# EAGLE design ElectronPhotonTestHarness (EAGLE 7.4.0)
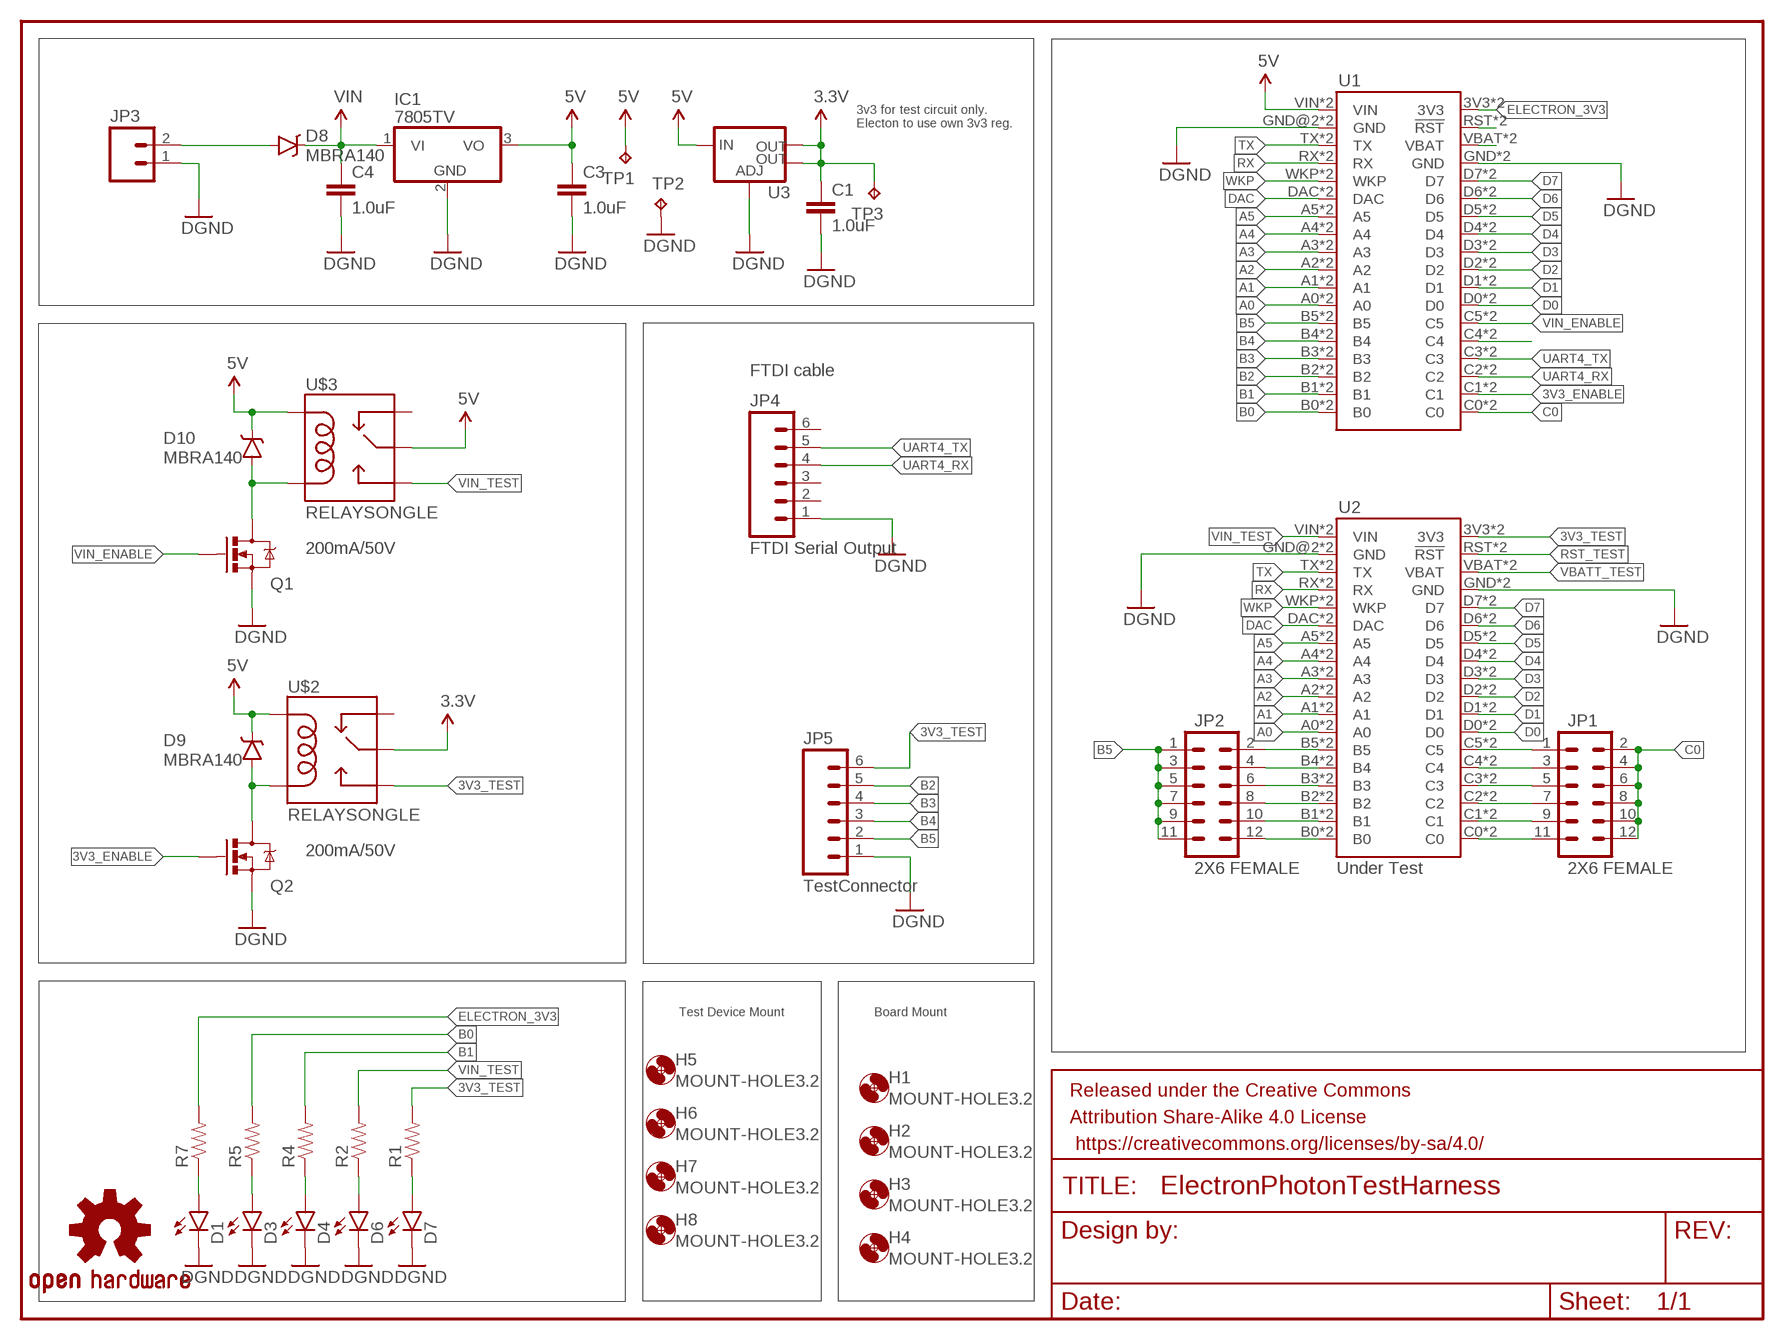
[diagram p0: schematic, sheet 1]

## Parts
C1  1.0uF  1.0UF-25V-+80/-20(0805)"  [0805-CAP]
C3  1.0uF  1.0UF-25V-+80/-20(0805)"  [0805-CAP]
C4  1.0uF  1.0UF-25V-+80/-20(0805)"  [0805-CAP]
D1  LED1206-BOTTOM  [LED-1206-BOTTOM]
D3  LED1206  [LED-1206]
D4  LED1206  [LED-1206]
D6  LED1206  [LED-1206]
D7  LED1206  [LED-1206]
D8  MBRA140  [SMA-DIODE]
D9  MBRA140  [SMA-DIODE]
D10  MBRA140  [SMA-DIODE]
FRAME1  FRAME-LETTER  [CREATIVE_COMMONS]
H1  MOUNT-HOLE3.2  [3,2]
H2  MOUNT-HOLE3.2  [3,2]
H3  MOUNT-HOLE3.2  [3,2]
H4  MOUNT-HOLE3.2  [3,2]
H5  MOUNT-HOLE3.2  [3,2]
H6  MOUNT-HOLE3.2  [3,2]
H7  MOUNT-HOLE3.2  [3,2]
H8  MOUNT-HOLE3.2  [3,2]
IC1  7805TV  [TO220V]
JP1  2X6 FEMALE  M06X2PTH_FEMALE  [2X6]
JP2  2X6 FEMALE  M06X2PTH_FEMALE  [2X6]
JP3  M025MM  [SCREWTERMINAL-5MM-2]
JP4  FTDI Serial Output  M06SILK_FEMALE_PTH  [1X06]
JP5  TestConnector  M06SILK_FEMALE_PTH  [1X06]
LOGO1  OSHW-LOGOL  [OSHW-LOGO-L]
Q1  200mA/50V  MOSFET-NCHANNELBSS138  [SOT23-3]
Q2  200mA/50V  MOSFET-NCHANNELBSS138  [SOT23-3]
R1  RESISTOR1206  [1206]
R2  RESISTOR1206  [1206]
R4  RESISTOR1206  [1206]
R5  RESISTOR1206  [1206]
R7  RESISTOR1206  [1206]
TP1  TPTP12SQ  [TP12SQ]
TP2  TPTP12SQ  [TP12SQ]
TP3  TPTP12SQ  [TP12SQ]
U1  ELECTRONDUALNAMED  [ELECTRON_SIMPLE_SILK_NAMES_DUAL]
U2  UnderTest  ELECTRONDUALNAMED  [ELECTRON_SIMPLE_SILK_NAMES_DUAL]
U3  V_REG_LM1117SOT223  [SOT223]
U$2  RELAYSONGLE  [SRD-5VDC-SL-C]
U$3  RELAYSONGLE  [SRD-5VDC-SL-C]

## Nets
3.3V: C1.1 TP3.TP U3.2(OUT) U3.4(OUT) U$2.COMMON(MAIN)
3V3_ENABLE: Q2.1(G) U1.C1 U1.C1_1(C1)
3V3_TEST: JP5.6 R1.2 U2.3V3 U2.3V3_1(3V3) U$2.OPEN(NO)
5V: C3.1 D9.C D10.C IC1.3(VO) TP1.TP U1.VIN U1.VIN_1B(VIN) U3.3(IN) U$2.COIL1 U$3.COIL1 U$3.COMMON(MAIN)
A0: U1.A0 U1.A0_1(A0) U2.A0 U2.A0_1(A0)
A1: U1.A1 U1.A1_1(A1) U2.A1 U2.A1_1(A1)
A2: U1.A2 U1.A2_1(A2) U2.A2 U2.A2_1(A2)
A3: U1.A3 U1.A3_1(A3) U2.A3 U2.A3_1(A3)
A4: U1.A4 U1.A4_1(A4) U2.A4 U2.A4_1(A4)
A5: U1.A5 U1.A5_1(A5) U2.A5 U2.A5_1(A5)
B0: R5.2 U1.B0 U1.B0_1(B0)
B1: R4.2 U1.B1 U1.B1_1(B1)
B2: JP5.5 U1.B2 U1.B2_1(B2)
B3: JP5.4 U1.B3 U1.B3_1(B3)
B4: JP5.3 U1.B4 U1.B4_1(B4)
B5: JP2.1 JP2.3 JP2.5 JP2.7 JP2.9 JP2.11 JP5.2 U1.B5 U1.B5_1(B5)
C0: JP1.2 JP1.4 JP1.6 JP1.8 JP1.10 JP1.12 U1.C0 U1.C0_1(C0)
D0: U1.D0 U1.D0_1(D0) U2.D0 U2.D0_1(D0)
D1: U1.D1 U1.D1_1(D1) U2.D1 U2.D1_1(D1)
D2: U1.D2 U1.D2_1(D2) U2.D2 U2.D2_1(D2)
D3: U1.D3 U1.D3_1(D3) U2.D3 U2.D3_1(D3)
D4: U1.D4 U1.D4_1(D4) U2.D4 U2.D4_1(D4)
D5: U1.D5 U1.D5_1(D5) U2.D5 U2.D5_1(D5)
D6: U1.D6 U1.D6_1(D6) U2.D6 U2.D6_1(D6)
D7: U1.D7 U1.D7_1(D7) U2.D7 U2.D7_1(D7)
DAC: U1.DAC U1.DAC_1(DAC) U2.DAC U2.DAC_1(DAC)
ELECTRON_3V3: R7.2 U1.3V3 U1.3V3_1(3V3)
GND: C1.2 C3.2 C4.2 D1.C D3.C D4.C D6.C D7.C IC1.2(GND) JP3.1 JP4.1 JP5.1 Q1.2(S) Q2.2(S) TP2.TP U1.GND U1.GND@2(GND) U1.GND_1(GND) U1.GND_1B(GND) U2.GND U2.GND@2(GND) U2.GND_1(GND) U2.GND_1B(GND) U3.1(ADJ) ; supply symbol labelled DGND
N$1: JP2.2 U2.B5 U2.B5_1(B5)
N$2: JP2.4 U2.B4 U2.B4_1(B4)
N$3: JP2.6 U2.B3 U2.B3_1(B3)
N$4: JP2.8 U2.B2 U2.B2_1(B2)
N$5: JP2.10 U2.B1 U2.B1_1(B1)
N$6: JP2.12 U2.B0 U2.B0_1(B0)
N$7: JP1.11 U2.C0 U2.C0_1(C0)
N$8: JP1.9 U2.C1 U2.C1_1(C1)
N$9: JP1.7 U2.C2 U2.C2_1(C2)
N$10: JP1.5 U2.C3 U2.C3_1(C3)
N$11: JP1.3 U2.C4 U2.C4_1(C4)
N$12: JP1.1 U2.C5 U2.C5_1(C5)
N$13: D1.A R7.1
N$14: U1.RST(!RST) U1.RST_1(!RST)
N$15: D3.A R5.1
N$16: D4.A R4.1
N$17: U1.VBAT U1.VBATT_1(VBAT)
N$18: D6.A R2.1
N$19: D7.A R1.1
N$20: D8.A JP3.2
N$21: U1.C4 U1.C4_1(C4)
RELAY_3V3: D9.A Q2.3(D) U$2.COIL2
RELAY_5V: D10.A Q1.3(D) U$3.COIL2
RST_TEST: U2.RST(!RST) U2.RST_1(!RST)
RX: U1.RX U1.RX_1(RX) U2.RX U2.RX_1(RX)
TX: U1.TX U1.TX_1(TX) U2.TX U2.TX_1(TX)
UART4_RX: JP4.4 U1.C2 U1.C2_1(C2)
UART4_TX: JP4.5 U1.C3 U1.C3_1(C3)
VBATT_TEST: U2.VBAT U2.VBATT_1(VBAT)
VIN: C4.1 D8.C IC1.1(VI)
VIN_ENABLE: Q1.1(G) U1.C5 U1.C5_1(C5)
VIN_TEST: R2.2 U2.VIN U2.VIN_1B(VIN) U$3.OPEN(NO)
WKP: U1.WKP U1.WKP_1(WKP) U2.WKP U2.WKP_1(WKP)
Unconnected: JP4.2 JP4.3 JP4.6 U$2.CLOSED(NC) U$3.CLOSED(NC)

## Notes on the sheet
- 3v3 for test circuit only.
  Electon to use own 3v3 reg.
- FTDI cable
- Under Test
- Test Device Mount | Board Mount

## Library data of the parts
C1 C3 C4 = SparkFun-Capacitors:1.0UF-25V-+80/-20(0805): CAP-11625; PROD_ID: CAP-11625
D1 D3 D4 D6 D7 = SparkFun-LED:LED: LEDs Standard schematic elements and footprints for 5mm, 3mm, 1206, and 0603 sized LEDs. 5mm - Spark Fun Electronics SKU : COM-00529 (and others)
D8-D10 = SparkFun-DiscreteSemi:MBRA140: 40V, 1A Schottky rectifier SMA/DO-214AC package DIO-08053; PROD_ID: DIO-08053
FRAME1 = SparkFun-Aesthetics:FRAME-LETTER: Schematic Frame Standard 8.5x11 US Letter frame
H1-H8 = holes:MOUNT-HOLE: MOUNTING HOLE with drill center marker
IC1 = linear:78*: Positive VOLTAGE REGULATOR Source: http://cache.national.com/ds/LM/LM78L05.pdf http://www.fairchildsemi.com/ds/LM/LM7805.pdf
JP1 JP2 = SparkFun-Connectors:M06X2; PROD_ID: CONN-12423
JP3 = SparkFun-Connectors:M02: Standard 2-pin 0.1" header. Use with - straight break away headers ( PRT-00116) - right angle break away headers (PRT-00553) - swiss pins (PRT-00743) - machine pins (PRT-00117) - female headers (PRT-00115) Molex polarized connector foot print use with: PRT-08233 with associated crimp pins and housings. 2.54_SCREWTERM for use with PRT-10571. 3.5mm Screw Terminal footprints for PRT-08084 5mm Screw Terminal footprints for use with PRT-08432; STOREFRONT_ID: PRT-08432
JP4 JP5 = SparkFun-Connectors:M06: Header 6 Standard 6-pin 0.1" header. Use with straight break away headers (SKU : PRT-00116), right angle break away headers (PRT-00553), swiss pins (PRT-00743), machine pins (PRT-00117), and female headers (PRT-00115). Molex polarized connector foot print use with SKU : PRT-08094 with associated crimp pins and housings. NOTES ON THE VARIANTS LOCK and LOCK_LONGPADS... This footprint was designed to help hold the alignment of a through-hole component (i.e. 6-pin header) while soldering it into place. You may notice that each hole has been shifted either up or down by 0.005 of an inch from it's more standard position (which is a perfectly straight line). This slight alteration caused the pins (the squares in the middle) to touch the edges of the holes. Because they are alternating, it causes a "brace" to hold the component in place. 0.005 has proven to be the perfect amount of "off-center" position when using our standard breakaway headers. Although looks a little odd when you look at the bare footprint, once you have a header in there, the alteration is very hard to notice. Also,if you push a header all the way into place, it is covered up entirely on the bottom side. This idea of altering the position of holes to aid alignment will be further integrated into the Sparkfun Library for other footprints. It can help hold any component with 3 or more connection pins.; PROD_ID: CONN-08437
LOGO1 = SparkFun-Aesthetics:OSHW-LOGO: Open Source Hardware Logo This logo indicates the piece of hardware it is found on incorporates a OSHW license and/or adheres to the definition of open source hardware found here: http://freedomdefined.org/OSHW
Q1 Q2 = SparkFun-DiscreteSemi:MOSFET-NCHANNEL: Common NMOSFET Parts MFG P/N Store ID Prod ID FDD8780 TRANS-09984 SI7820DN TRANS-11055 FDS6630A IC-08089 2N7002PW TRANS-11151 FQP30N06L COM-10213 TRANS-10060 BSS123LT1G TRANS-08345 BSS138 TRANS-00830 BS170 2N7000; PROD_ID: TRANS-00830
R1 R2 R4 R5 R7 = SparkFun-Resistors:RESISTOR: Resistor Basic schematic elements and footprints for 0603, 1206, and PTH resistors.
TP1-TP3 = testpad:TP: Test pad
U1 U2 = Tinamous:ELECTRON
U3 = SparkFun-PowerIC:V_REG_LM1117: Voltage Regulator LM1117 Standard adjustable voltage regulator but in SMD form. Spark Fun Electronics SKU : COM-00595; PROD_ID: VREG-08170
U$2 U$3 = Particle:RELAY: SPDT relay (COM-00101)

## Board
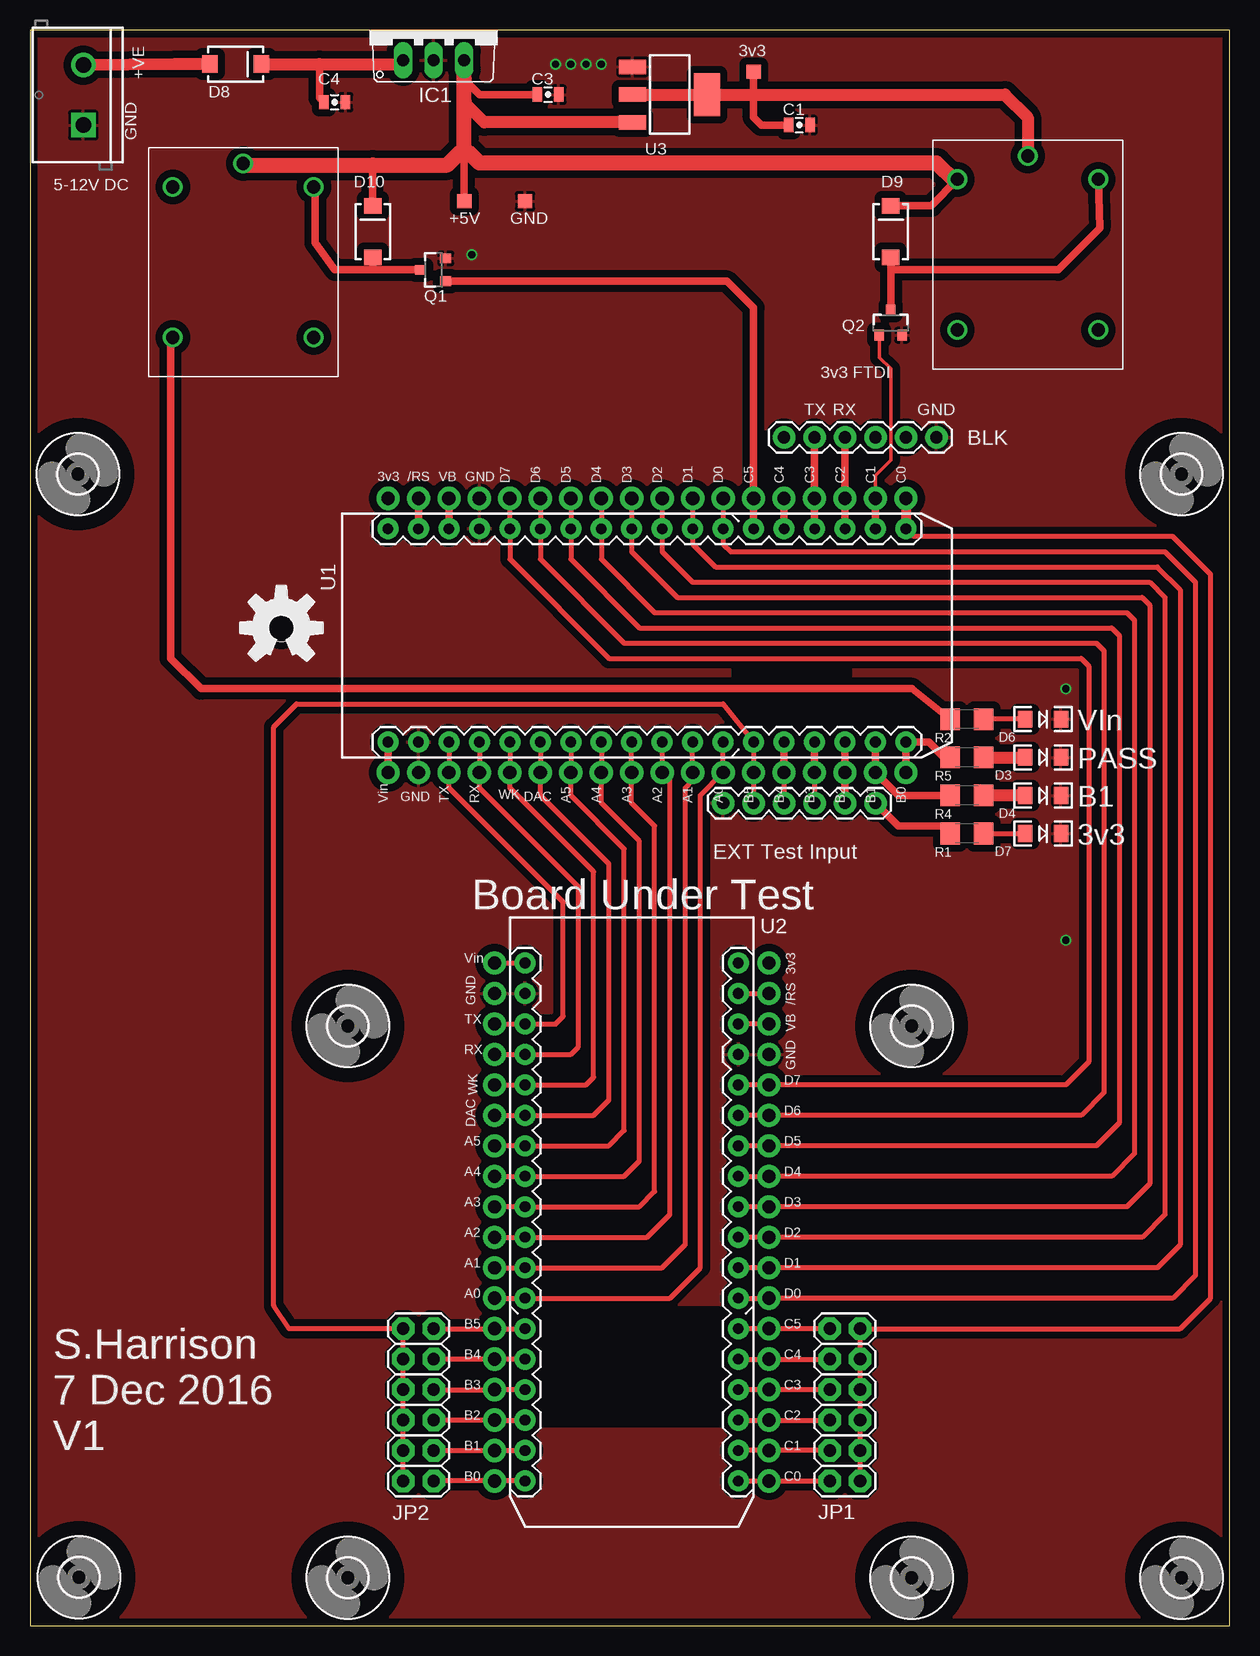
[diagram p1: board, top side]
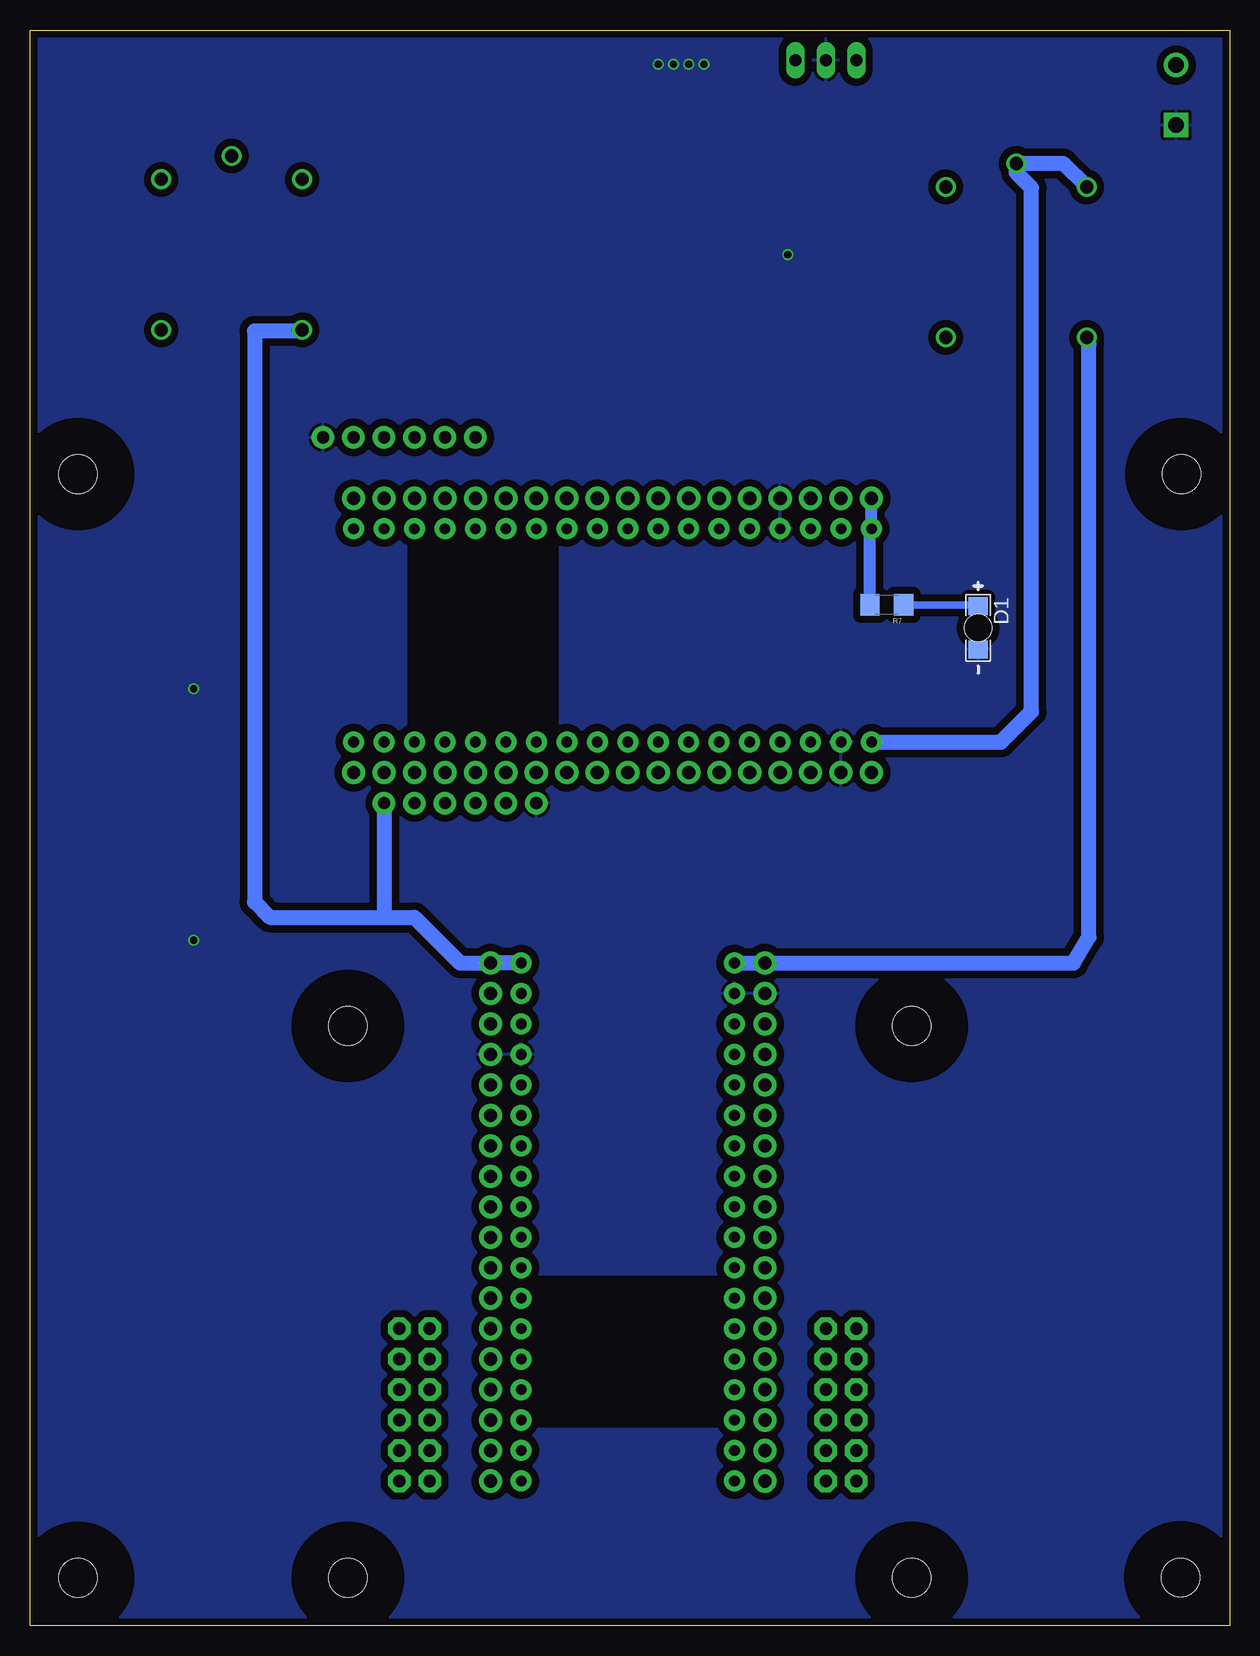
[diagram p2: board, bottom side, seen from below]

Size 100 x 133.02 mm. Coordinates in mm from the lower left corner, seen from the top.
Outline: 0,0 100,0 100,133.02 0,133.02 0,0
Copper layers (1*16): Top 0.035mm / dielectric 1.5mm / Bottom 0.035mm
Design rules "dirt_cheap_dirty_boards.v1": minimum track width 5mil, minimum drill 12mil, track to track 5mil, track to pad 5mil, pad to pad 5mil, via to via 5mil, smd to smd 0mil, copper to edge 10mil, drill to drill 10mil, minimum pad ring 10mil, minimum via ring 6mil, stop-mask expansion 2mil, vias tented up to drill 25mil, thermal gap 10mil

### Footprints (pad centres in the part's own frame; a part is rotated, then mirrored left to right if it is on the bottom)
0805-CAP = smd 0.8 x 1.2: 1 -0.9,0; 2 0.9,0
LED-1206-BOTTOM = smd 1.5 x 1.6: A -1.8,0; C 1.8,0 | hole 2.3: 0,0
LED-1206 = smd 1.2 x 1.4: A -1.5,0; C 1.5,0
SMA-DIODE = smd 1.27 x 1.47: A -2.15,0; C 2.15,0
3,2 = hole 3.2: 0,0
TO220V = drill 1.016 long: 1 -2.54,-2.54; 2 0,-2.54; 3 2.54,-2.54
2X6 = drill 1.016 pad 1.88 octagon: 1 0,0; 2 0,2.54; 3 2.54,0; 4 2.54,2.54; 5 5.08,0; 6 5.08,2.54; 7 7.62,0; 8 7.62,2.54; 9 10.16,0; 10 10.16,2.54; 11 12.7,0; 12 12.7,2.54
SCREWTERMINAL-5MM-2 = drill 1.3 pad 2.032 square: 1 0,0 | drill 1.3 pad 2.032: 2 5,0
1X06 = drill 1.016 pad 1.88: 1 0,0; 2 2.54,0; 3 5.08,0; 4 7.62,0; 5 10.16,0; 6 12.7,0
SOT23-3 = smd 0.8 x 0.9: 1 -0.95,-1; 2 0.95,-1; 3 0,1.1
1206 = smd 1.6 x 1.8: 1 -1.4,0; 2 1.4,0
TP12SQ = smd 1.2 x 1.2: TP 0,0
ELECTRON_SIMPLE_SILK_NAMES_DUAL = drill 0.889 pad 1.753: 3V3 1.27,22.86; A0 29.21,5.08; A1 26.67,5.08; A2 24.13,5.08; A3 21.59,5.08; A4 19.05,5.08; A5 16.51,5.08; B0 44.45,5.08; B1 41.91,5.08; B2 39.37,5.08; B3 36.83,5.08; B4 34.29,5.08; B5 31.75,5.08; C0 44.45,22.86; C1 41.91,22.86; C2 39.37,22.86; C3 36.83,22.86; C4 34.29,22.86; C5 31.75,22.86; D0 29.21,22.86; D1 26.67,22.86; D2 24.13,22.86; D3 21.59,22.86; D4 19.05,22.86; D5 16.51,22.86; D6 13.97,22.86; D7 11.43,22.86; DAC 13.97,5.08; GND 8.89,22.86; GND@2 3.81,5.08; RST 3.81,22.86; RX 8.89,5.08; TX 6.35,5.08; VBAT 6.35,22.86; VIN 1.27,5.08; WKP 11.43,5.08 | drill 1.1 pad 1.93: 3V3_1 1.27,25.4; A0_1 29.21,2.54; A1_1 26.67,2.54; A2_1 24.13,2.54; A3_1 21.59,2.54; A4_1 19.05,2.54; A5_1 16.51,2.54; B0_1 44.45,2.54; B1_1 41.91,2.54; B2_1 39.37,2.54; B3_1 36.83,2.54; B4_1 34.29,2.54; B5_1 31.75,2.54; C0_1 44.45,25.4; C1_1 41.91,25.4; C2_1 39.37,25.4; C3_1 36.83,25.4; C4_1 34.29,25.4; C5_1 31.75,25.4; D0_1 29.21,25.4; D1_1 26.67,25.4; D2_1 24.13,25.4; D3_1 21.59,25.4; D4_1 19.05,25.4; D5_1 16.51,25.4; D6_1 13.97,25.4; D7_1 11.43,25.4; DAC_1 13.97,2.54; GND_1 8.89,25.4; GND_1B 3.81,2.54; RST_1 3.81,25.4; RX_1 8.89,2.54; TX_1 6.35,2.54; VBATT_1 6.35,25.4; VIN_1B 1.27,2.54; WKP_1 11.43,2.54
SOT223 = smd 1.219 x 2.235: 1 -2.311,-3.099; 2 0,-3.099; 3 2.311,-3.099 | smd 3.6 x 2.2: 4 0,3.099
SRD-5VDC-SL-C = drill 1.1: CLOSED -6.275,-5.875; COIL1 6.275,5.875; COIL2 6.275,-5.875; COMMON 8.225,0; OPEN -6.275,5.875

### Placement (x,y rotation side)
C1  64.14,125.09 0 top
C3  43.18,127.64 0 top
C4  25.4,127 0 top
D1  20.95,83.19 270 bottom
D3  84.45,72.39 0 top
D4  84.45,69.22 0 top
D6  84.45,75.56 0 top
D7  84.45,66.04 0 top
D8  17.14,130.18 0 top
D9  71.75,116.2 90 top
D10  28.57,116.2 90 top
FRAME1  16.51,-13.34 0 top  (outside the outline)
H1  4.08,4.03 0 top
H2  96,4 0 top
H3  4,96 0 top
H4  96,96 0 top
H5  73.5,50 0 top
H6  26.5,50 0 top
H7  26.5,4 0 top
H8  73.5,4 0 top
IC1  33.66,133.03 0 top
JP1  66.67,24.77 270 top
JP2  31.11,24.77 270 top
JP3  4.45,125.09 90 top
JP4  75.56,99.06 180 top
JP5  57.78,68.58 0 top
LOGO1  20.95,83.19 0 top
Q1  33.66,113.03 90 top
Q2  71.75,108.58 0 top
R1  78.11,66.04 180 top
R2  78.11,75.56 180 top
R4  78.11,69.22 180 top
R5  78.11,72.39 180 top
R7  28.57,85.09 180 bottom
TP1  36.2,118.75 0 top
TP2  41.27,118.75 0 top
TP3  60.33,129.54 0 top
U1  28.57,68.58 0 top
U2  36.2,56.52 270 top
U3  53.34,127.64 270 top
U$2  83.19,114.3 90 top
U$3  17.78,113.67 90 top

### Tracks (layer width: path | path; a pad name or v marks a point on that pad's centre or on a via)
3.3V
  Top 0.61: C1.1 60.96,125.09 60.33,125.73 60.33,127.64 TP3.TP
  Top 1.016: U$2.COMMON 83.19,125.73 81.28,127.64 60.33,127.64 U3.4 U3.2
  Bottom 1.016: U$2.COMMON 83.19,122.56
3V3_ENABLE
  Top 0.305: U1.C1_1 70.48,95.89 71.75,97.16 71.75,104.78 70.81,105.72 Q2.1
  Top 0.61: U1.C1 U1.C1_1
3V3_TEST
  Top 0.406: R1.2 76.2,66.67
  Top 0.61: 76.2,66.67 72.39,66.67 JP5.6
  Bottom 1.27: 70.48,59.05 80.01,59.05 81.28,60.33 81.28,107.95 77.47,107.95 77.19,108.23 U$2.OPEN | 70.48,59.05 67.94,59.05 64.14,55.24 U2.3V3_1 U2.3V3 | JP5.6 70.48,59.05
5V
  Top 0.61: D9.C 75.15,118.36 U$2.COIL1 | D10.C 28.57,121.77 | U1.VIN_1B U1.VIN | C3.1 37.47,127.64 36.2,128.91 | TP1.TP 36.2,122.87
  Top 1.016: U3.3 37.87,125.32 36.2,127
  Top 1.27: IC1.3 36.2,128.91 36.2,127 36.2,123.19 35.88,122.87 | 35.88,122.87 34.77,121.77 28.57,121.77 17.9,121.77 U$3.COMMON | U$2.COIL1 77.09,120.4 75.56,121.92 37.47,121.92 36.51,122.87 36.2,122.87 35.88,122.87
  Bottom 1.27: U1.VIN 19.05,73.66 16.51,76.2 16.51,119.86 17.78,121.13 U$3.COMMON 13.86,121.89 U$3.COIL1
A0
  Top 0.406: U2.A0_1 U2.A0 53.34,27.3 55.88,29.84 55.88,69.22 U1.A0_1 U1.A0
A1
  Top 0.406: U2.A1_1 U2.A1 52.7,29.84 54.61,31.75 54.61,69.85 55.24,70.48 U1.A1_1 U1.A1
A2
  Top 0.406: U2.A2_1 U2.A2 51.44,32.38 53.34,34.29 53.34,70.48 U1.A2_1 U1.A2
A3
  Top 0.406: U2.A3_1 U2.A3 50.8,34.92 52.07,36.2 52.07,66.67 50.16,68.58 U1.A3_1 U1.A3
A4
  Top 0.406: U2.A4_1 U2.A4 49.53,37.47 50.8,38.73 50.8,65.41 47.62,68.58 U1.A4_1 U1.A4
A5
  Top 0.406: U2.A5_1 U2.A5 48.26,40.01 49.53,41.27 49.53,64.77 45.09,69.22 U1.A5_1 U1.A5
B0
  Top 0.61: R5.2 76.2,72.39 74.93,73.66 U1.B0 U1.B0_1
B1
  Top 0.61: R4.2 72.39,69.22 U1.B1_1 U1.B1
B2
  Top 0.61: U1.B2 U1.B2_1 JP5.5
B3
  Top 0.406: U1.B3_1 JP5.4
  Top 0.61: U1.B3_1 U1.B3
B4
  Top 0.406: U1.B4_1 JP5.3
  Top 0.61: U1.B4 U1.B4_1
B5
  Top 0.406: JP2.11 JP2.9 JP2.7 JP2.5 JP2.3 JP2.1 21.59,24.77 20.32,26.67 20.32,74.93 22.23,76.83 57.78,76.83 U1.B5 U1.B5_1 JP5.2
C0
  Top 0.406: JP1.12 JP1.10 JP1.8 JP1.6 JP1.4 JP1.2 95.89,24.77 98.42,27.3 98.42,87.63 95.25,90.81 73.66,90.81 U1.C0
  Top 0.813: U1.C0_1 U1.C0
D0
  Top 0.406: U2.D0 U2.D0_1 95.25,27.3 97.16,29.21 97.16,87 94.61,89.53 58.42,89.53 57.78,90.17 U1.D0 U1.D0_1
D1
  Top 0.406: U2.D1 U2.D1_1 93.98,29.84 95.89,31.75 95.89,86.36 93.98,88.27 57.15,88.27 55.24,90.17 U1.D1 U1.D1_1
D2
  Top 0.406: U2.D2 U2.D2_1 92.71,32.38 94.61,34.29 94.61,85.72 93.34,87 55.24,87 52.7,89.53 U1.D2 U1.D2_1
D3
  Top 0.406: U2.D3 U2.D3_1 91.44,34.92 93.34,36.83 93.34,85.09 92.71,85.72 53.98,85.72 50.16,89.53 U1.D3 U1.D3_1
D4
  Top 0.406: U2.D4 U2.D4_1 90.17,37.47 92.08,39.37 92.08,83.82 91.44,84.45 52.07,84.45 47.62,88.9 U1.D4 U1.D4_1
D5
  Top 0.406: U2.D5 U2.D5_1 88.9,40.01 90.81,41.91 90.81,82.55 90.17,83.19 50.8,83.19 45.09,88.9 U1.D5 U1.D5_1
D6
  Top 0.406: U2.D6 U2.D6_1 87.63,42.55 89.53,44.45 89.53,81.28 88.9,81.92 49.53,81.92 42.55,88.9 U1.D6 U1.D6_1
D7
  Top 0.406: U2.D7 U2.D7_1 86.36,45.09 88.27,46.99 88.27,80.01 87.63,80.64 48.26,80.64 40.01,88.9 U1.D7 U1.D7_1
DAC
  Top 0.406: U2.DAC_1 U2.DAC 46.99,42.55 48.26,43.81 48.26,63.5 42.55,69.22 U1.DAC_1 U1.DAC
ELECTRON_3V3
  Bottom 1.016: R7.2 29.98,91.31 U1.3V3 U1.3V3_1
GND  (via drill 0.6)
  other vias: 36.83,114.3 47.62,130.18 46.35,130.18 45.09,130.18 43.81,130.18 86.36,57.15 86.36,78.11
  pour Bottom (isolate 0.61, rank 5): -0.64,136.53 100.33,136.53 100.33,-0.64 -0.64,-0.64
  pour Top (isolate 0.61, rank 5): -0.64,139.06 100.33,139.06 100.33,0.64 99.06,-0.64 0,-0.64
N$1
  Top 0.406: JP2.2 U2.B5_1 U2.B5
N$2
  Top 0.406: U2.B4 U2.B4_1 JP2.4
N$3
  Top 0.406: JP2.6 U2.B3_1 U2.B3
N$4
  Top 0.406: U2.B2 U2.B2_1 JP2.8
N$5
  Top 0.406: JP2.10 U2.B1_1 U2.B1
N$6
  Top 0.406: U2.B0 U2.B0_1 JP2.12
N$7
  Top 0.406: U2.C0_1 U2.C0 JP1.11
N$8
  Top 0.406: JP1.9 U2.C1_1 U2.C1
N$9
  Top 0.406: U2.C2_1 U2.C2 JP1.7
N$10
  Top 0.406: JP1.5 U2.C3_1 U2.C3
N$11
  Top 0.406: U2.C4_1 U2.C4 JP1.3
N$12
  Top 0.406: JP1.1 U2.C5_1 U2.C5
N$13
  Bottom 0.61: R7.1 21.06,85.09 D1.A
N$14
  Top 0.61: U1.RST U1.RST_1
N$15
  Top 1.016: R5.1 D3.A
N$16
  Top 1.016: D4.A R4.1
N$17
  Top 0.61: U1.VBATT_1 U1.VBAT
N$18
  Top 0.406: D6.A R2.1
N$19
  Top 0.406: R1.1 D7.A
N$20
  Top 1.016: D8.A 12.06,130.18 JP3.2
N$21
  Top 0.61: U1.C4 U1.C4_1
RELAY_3V3
  Top 0.61: U$2.COIL2 89.18,116.48 85.72,113.03 71.75,113.03 | 71.75,113.03 Q2.3 | D9.A 71.75,113.03
RELAY_5V
  Top 0.61: 28.57,113.03 25.4,113.03 23.77,115.29 23.77,119.82 U$3.COIL2 | 28.57,113.03 Q1.3 | D10.A 28.57,113.03
RST_TEST
  Top 0.406: U2.RST U2.RST_1
RX
  Top 0.406: U2.RX U2.RX_1 45.09,47.62 45.72,48.26 45.72,61.59 37.47,69.85 U1.RX_1 U1.RX
TX
  Top 0.406: U2.TX U2.TX_1 43.81,50.16 44.45,50.8 44.45,60.33 34.92,69.85 U1.TX_1 U1.TX
UART4_RX
  Top 0.61: U1.C2_1 U1.C2 JP4.4
UART4_TX
  Top 0.61: U1.C3_1 U1.C3 JP4.5
VBATT_TEST
  Top 0.406: U2.VBATT_1 U2.VBAT
VIN
  Top 0.61: C4.1 24.13,127.37 24.13,130.18
  Top 1.016: D8.C 24.13,130.18 30.48,130.18 IC1.1
VIN_ENABLE
  Top 0.61: U1.C5 U1.C5_1 60.33,109.86 58.1,112.08 Q1.1
VIN_TEST
  Top 0.406: U2.VIN_1B U2.VIN
  Top 0.61: R2.2 73.53,78.11 14.26,78.11 11.72,80.64 11.72,107.2 U$3.OPEN 11.54,107.39 11.47,107.46
  Bottom 1.27: U2.VIN 13.01,55.24 11.72,57.4 11.72,106.83 U$3.OPEN
WKP
  Top 0.406: U2.WKP_1 U2.WKP 46.35,45.09 46.99,45.72 46.99,62.87 40.01,69.85 U1.WKP_1 U1.WKP

### Text on the board
tNames: 3v3 | +VE | GND | 5-12V DC | +5V | GND | 3v3 FTDI | TX | RX | GND | BLK | VIn | PASS | B1 | 3v3 | EXT Test Input | Board Under Test | S.Harrison | 7 Dec 2016 | V1